# EAGLE schematic CANtranslator (EAGLE 6.1)
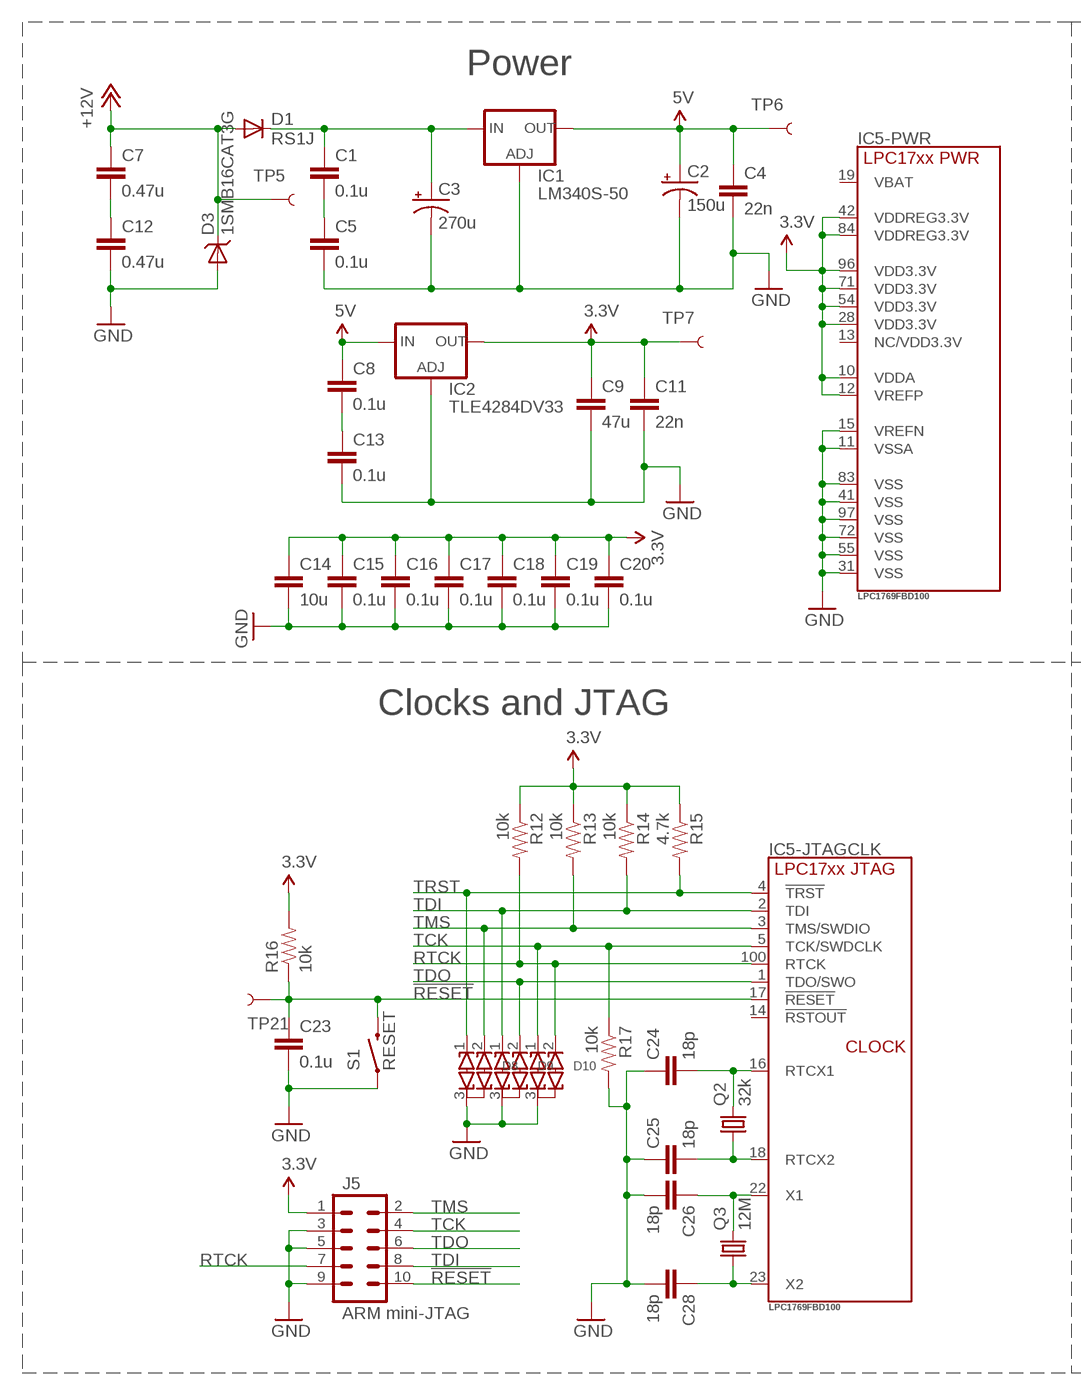
[diagram p0: schematic, sheet 1, part 1 of 2]
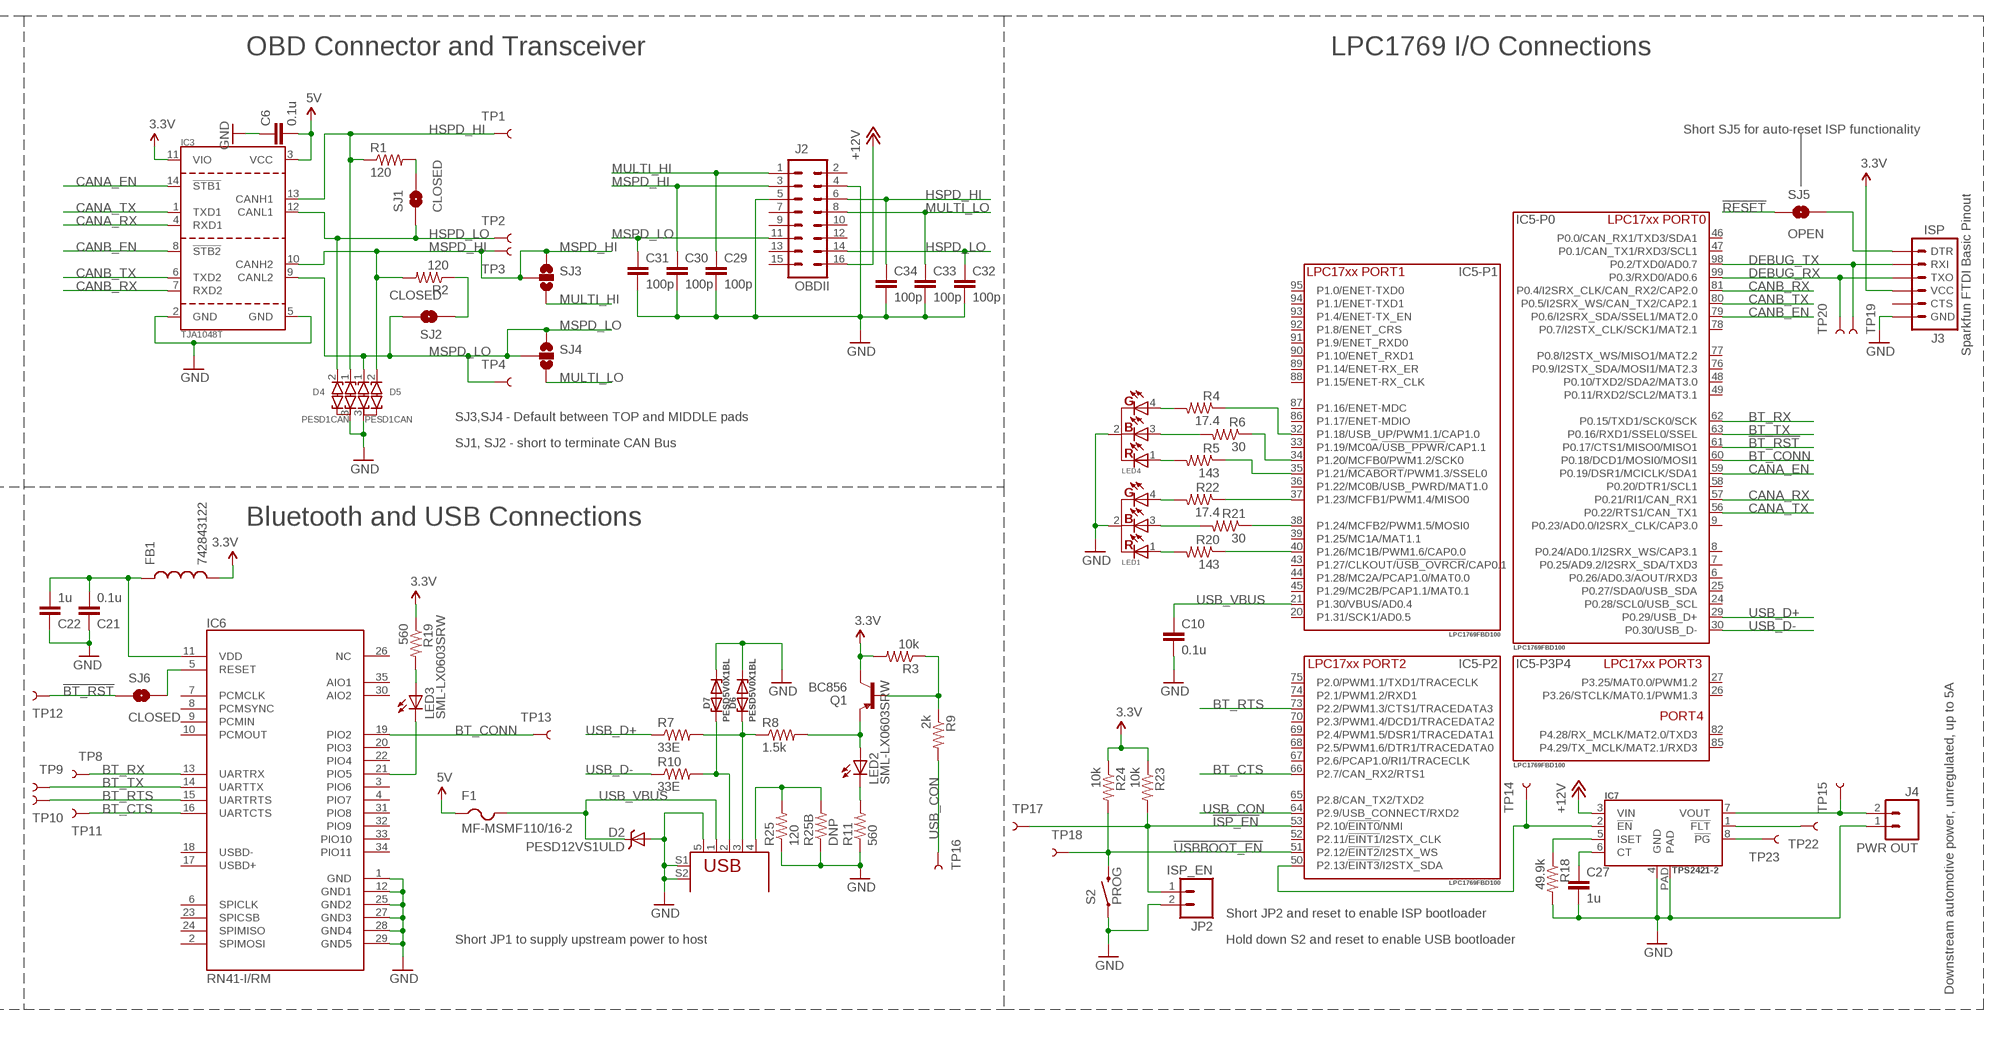
[diagram p1: schematic, sheet 1, part 2 of 2]

## Parts
C1  0.1u  CAP0805  [0805]
C2  150u  CAP_POL5MMX2D  [CPOL-5MMX2D]
C3  270u  CAP_POL10MMX5D  [CPOL-10MMX5D]
C4  22n  CAP0402-CAP  [0402-CAP]
C5  0.1u  CAP0805  [0805]
C6  0.1u  CAP0402-CAP  [0402-CAP]
C7  0.47u  CAP0805  [0805]
C8  0.1u  CAP0805  [0805]
C9  47u  CAP1210  [1210]
C10  0.1u  CAP0402-CAP  [0402-CAP]
C11  22n  CAP0402-CAP  [0402-CAP]
C12  0.47u  CAP0805  [0805]
C13  0.1u  CAP0805  [0805]
C14  10u  CAP0805  [0805]
C15  0.1u  CAP0402-CAP  [0402-CAP]
C16  0.1u  CAP0402-CAP  [0402-CAP]
C17  0.1u  CAP0402-CAP  [0402-CAP]
C18  0.1u  CAP0402-CAP  [0402-CAP]
C19  0.1u  CAP0402-CAP  [0402-CAP]
C20  0.1u  CAP0402-CAP  [0402-CAP]
C21  0.1u  CAP0402-CAP  [0402-CAP]
C22  1u  CAP0402-CAP  [0402-CAP]
C23  0.1u  CAP0402-CAP  [0402-CAP]
C24  18p  CAP0402-CAP  [0402-CAP]
C25  18p  CAP0402-CAP  [0402-CAP]
C26  18p  CAP0402-CAP  [0402-CAP]
C27  1u  CAP0402-CAP  [0402-CAP]
C28  18p  CAP0402-CAP  [0402-CAP]
C29  100p  CAP0402-CAP  [0402-CAP]
C30  100p  CAP0402-CAP  [0402-CAP]
C31  100p  CAP0402-CAP  [0402-CAP]
C32  100p  CAP0402-CAP  [0402-CAP]
C33  100p  CAP0402-CAP  [0402-CAP]
C34  100p  CAP0402-CAP  [0402-CAP]
D1  RS1J  DIODESMA  [SMA-DIODE]
D2  PESD12VS1ULD  DIODE-TVS-SOD882D  [SOD-882D]
D3  1SMB16CAT3G  DIODE-TVS-SMB  [SMB-DIODE]
D4  PESD1CAN  DIODE_ESD_DUAL-SOT-23  [SOT23]
D5  PESD1CAN  DIODE_ESD_DUAL-SOT-23  [SOT23]
D6  PESD5V0X1BL  DIODE_ESD_BI-SOD882  [SOD-882]
D7  PESD5V0X1BL  DIODE_ESD_BI-SOD882  [SOD-882]
D8  DIODE_ESD_DUAL-SOT-1123  [SOT-1123]
D9  DIODE_ESD_DUAL-SOT-1123  [SOT-1123]
D10  DIODE_ESD_DUAL-SOT-1123  [SOT-1123]
F1  MF-MSMF110/16-2  PTCFUSE-1206  [R1206]
FB1  742843122  INDUCTOR0402  [C0402]
IC1  LM340S-50  V_REG_317DPACK  [V-REG_DPACK]
IC2  TLE4284DV33  V_REG_317DPACK  [V-REG_DPACK]
IC3  TJA1048T  TJA1048-SO14  [SO14]
IC5  LPC1769FBD100  LPC1768_SPLIT-TQFP  [TQFP100]
IC6  RN41-I/RM  BLUETOOTH-RN41"  [RN41]
IC7  TPS2421-2  TPS2421SO8  [POWER_SO8]
J1  USB_MINIB_SHIELD-10118193  [10118193]
J2  OBDII  M08X2-OBDII-COMTECH  [OBDII-COMTECH]
J3  ISP  ARDUINO_SERIAL_PROGRAMPTH  [1X06]
J4  PWR OUT  M022-1445055-2  [2-1445055-2]
J5  ARM mini-JTAG  M05X2-SHF-105-01-X-D-SM  [SHF-105-01-X-D-SM]
JP2  ISP_EN  M02PTH  [1X02]
LED1  RGB  LED_3X_COMMON_CATHODE  [LED5MM-RGB]
LED2  SML-LX0603SRW  LED0603  [LED-0603]
LED3  SML-LX0603SRW  LED0603  [LED-0603]
LED4  RGB  LED_3X_COMMON_CATHODE  [LED5MM-RGB]
Q1  BC856  TRANSISTOR_PNPSMD  [SOT23-3]
Q2  32k  CRYSTAL-ST2012SB  [ST2012SB]
Q3  12M  CRYSTAL-CX3225SB  [CX3225SB]
R1  120  RESISTOR0402-RES  [0402-RES]
R2  120  RESISTOR0402-RES  [0402-RES]
R3  10k  RESISTOR0402-RES  [0402-RES]
R4  17.4  RESISTOR0402-RES  [0402-RES]
R5  143  RESISTOR0402-RES  [0402-RES]
R6  30  RESISTOR0402-RES  [0402-RES]
R7  33E  RESISTOR0402-RES  [0402-RES]
R8  1.5k  RESISTOR0402-RES  [0402-RES]
R9  2k  RESISTOR0402-RES  [0402-RES]
R10  33E  RESISTOR0402-RES  [0402-RES]
R11  560  RESISTOR0402-RES  [0402-RES]
R12  10k  RESISTOR0402-RES  [0402-RES]
R13  10k  RESISTOR0402-RES  [0402-RES]
R14  10k  RESISTOR0402-RES  [0402-RES]
R15  4.7k  RESISTOR0402-RES  [0402-RES]
R16  10k  RESISTOR0402-RES  [0402-RES]
R17  10k  RESISTOR0402-RES  [0402-RES]
R18  49.9k  RESISTOR0402-RES  [0402-RES]
R19  560  RESISTOR0402-RES  [0402-RES]
R20  143  RESISTOR0402-RES  [0402-RES]
R21  30  RESISTOR0402-RES  [0402-RES]
R22  17.4  RESISTOR0402-RES  [0402-RES]
R23  10k  RESISTOR0402-RES  [0402-RES]
R24  10k  RESISTOR0402-RES  [0402-RES]
R25  120  RESISTOR0402-RES  [0402-RES]
R25B  DNP  RESISTORPTH-1/4W  [AXIAL-0.4]
S1  RESET  SWITCH-MOMENTARY-2-SMD-1101NE  [TACTILE-SWITCH-1101NE]
S2  PROG  SWITCH-MOMENTARY-2-SMD-1101NE  [TACTILE-SWITCH-1101NE]
SJ1  CLOSED  SOLDERJUMPERTRACE  [SJ_2S-TRACE]
SJ2  CLOSED  SOLDERJUMPERTRACE  [SJ_2S-TRACE]
SJ3  SOLDERJUMPER_2WAYPASTE1&2  [SJ_3_PASTE1&2]
SJ4  SOLDERJUMPER_2WAYPASTE1&2  [SJ_3_PASTE1&2]
SJ5  OPEN  SOLDERJUMPERNO  [SJ_2S-NO]
SJ6  CLOSED  SOLDERJUMPERTRACE  [SJ_2S-TRACE]
TP1  TEST-POINT3X5  [PAD.03X.05]
TP2  TEST-POINT3X5  [PAD.03X.05]
TP3  TEST-POINT3X5  [PAD.03X.05]
TP4  TEST-POINT3X5  [PAD.03X.05]
TP5  TEST-POINT3X5  [PAD.03X.05]
TP6  TEST-POINT3X5  [PAD.03X.05]
TP7  TEST-POINT3X5  [PAD.03X.05]
TP8  TEST-POINT3X5  [PAD.03X.05]
TP9  TEST-POINT3X5  [PAD.03X.05]
TP10  TEST-POINT3X5  [PAD.03X.05]
TP11  TEST-POINT3X5  [PAD.03X.05]
TP12  TEST-POINT3X5  [PAD.03X.05]
TP13  TEST-POINT3X5  [PAD.03X.05]
TP14  TEST-POINT3X5  [PAD.03X.05]
TP15  TEST-POINT3X5  [PAD.03X.05]
TP16  TEST-POINT3X5  [PAD.03X.05]
TP17  TEST-POINT3X5  [PAD.03X.05]
TP18  TEST-POINT3X5  [PAD.03X.05]
TP19  TEST-POINT3X5  [PAD.03X.05]
TP20  TEST-POINT3X5  [PAD.03X.05]
TP21  TEST-POINT3X5  [PAD.03X.05]
TP22  TEST-POINT3X5  [PAD.03X.05]
TP23  TEST-POINT3X5  [PAD.03X.05]

## Nets
3.3V: C9.1 C11.1 C14.1 C15.1 C16.1 C17.1 C18.1 C19.1 C20.1 FB1.2 IC2.4(OUT) IC3.11(VIO) IC5.10(-PWR:VDDA) IC5.12(-PWR:VREFP) IC5.28(-PWR:VDD3.3V) IC5.42(-PWR:VDDREG3.3V) IC5.54(-PWR:VDD3.3V) IC5.71(-PWR:VDD3.3V) IC5.84(-PWR:VDDREG3.3V) IC5.96(-PWR:VDD3.3V) J3.4(VCC) J5.1 Q1.3(C) R3.2 R12.1 R13.1 R14.1 R15.1 R16.2 R19.1 R23.1 R24.1 TP7.P$1
5V: C2.1(+) C4.1 C6.2 C8.1 F1.1 IC1.4(OUT) IC2.3(IN) IC3.3(VCC) TP6.P$1
!BT_RST: IC5.61(-P0:P0.17/CTS1/MISO0/MISO1) SJ6.1 TP12.P$1
!ISP_EN: IC5.53(-P2:P2.10/!EINT0!/NMI) JP2.1 R23.2 TP17.P$1
!RESET: C23.1 IC5.17(-JTAGCLK:!RESET) J5.10 R16.1 S1.P$2 SJ5.1 TP21.P$1
!USBBOOT_EN: IC5.51(-P2:P2.12/!EINT2!/I2STX_WS) R24.2 S2.P$2 TP18.P$1
+12V: C7.1 D1.A D3.C IC7.3(VIN) J2.16 TP5.P$1
BT_CONN: IC5.60(-P0:P0.18/DCD1/MOSI0/MOSI1) IC6.19(PIO2) TP13.P$1
BT_CTS: IC5.66(-P2:P2.7/CAN_RX2/RTS1) IC6.16(UARTCTS) TP11.P$1
BT_RTS: IC5.73(-P2:P2.2/PWM1.3/CTS1/TRACEDATA3) IC6.15(UARTRTS) TP10.P$1
BT_RX: IC5.62(-P0:P0.15/TXD1/SCK0/SCK) IC6.13(UARTRX) TP8.P$1
BT_TX: IC5.63(-P0:P0.16/RXD1/SSEL0/SSEL) IC6.14(UARTTX) TP9.P$1
CANA_EN: IC3.14(!STB1) IC5.59(-P0:P0.19/DSR1/MCICLK/SDA1)
CANA_RX: IC3.4(RXD1) IC5.57(-P0:P0.21/RI1/CAN_RX1)
CANA_TX: IC3.1(TXD1) IC5.56(-P0:P0.22/RTS1/CAN_TX1)
CANB_EN: IC3.8(!STB2) IC5.79(-P0:P0.6/I2SRX_SDA/SSEL1/MAT2.0)
CANB_RX: IC3.7(RXD2) IC5.81(-P0:P0.4/I2SRX_CLK/CAN_RX2/CAP2.0)
CANB_TX: IC3.6(TXD2) IC5.80(-P0:P0.5/I2SRX_WS/CAN_TX2/CAP2.1)
DEBUG_RX: IC5.99(-P0:P0.3/RXD0/AD0.6) J3.3(TXO) TP20.P$1
DEBUG_TX: IC5.98(-P0:P0.2/TXD0/AD0.7) J3.2(RXI) TP19.P$1
GND: C2.2(-) C3.1(-) C4.2 C5.2 C6.1 C9.2 C10.2 C11.2 C12.2 C13.2 C14.2 C15.2 C16.2 C17.2 C18.2 C19.2 C20.2 C21.1 C22.1 C23.2 C24.1 C25.1 C26.2 C27.2 C28.2 C29.2 C30.2 C31.2 C32.2 C33.2 C34.2 D2.2(A) D3.A D4.3(COM) D5.3(COM) D6.1 D7.1 D8.3(COM) D9.3(COM) D10.3(COM) IC1.1(ADJ) IC2.1(ADJ) IC3.2(GND) IC3.5(GND) IC5.11(-PWR:VSSA) IC5.15(-PWR:VREFN) IC5.31(-PWR:VSS) IC5.41(-PWR:VSS) IC5.55(-PWR:VSS) IC5.72(-PWR:VSS) IC5.83(-PWR:VSS) IC5.97(-PWR:VSS) IC6.1(GND) IC6.12(GND1) IC6.25(GND2) IC6.27(GND3) IC6.28(GND4) IC6.29(GND5) IC7.4(GND) IC7.PAD J1.5(GND) J1.S1 J1.S2 J2.4 J2.5 J3.6(GND) J4.1 J5.3 J5.5 J5.9 JP2.2 LED1.2(C) LED4.2(C) R11.1 R17.2 R18.2 R25.1 R25B.P$1 S1.P$1 S2.P$1
HSPD_HI: C34.1 D4.1(C1) IC3.13(CANH1) J2.6 R1.1 TP1.P$1
HSPD_LO: C32.1 D4.2(C2) IC3.12(CANL1) J2.14 SJ1.1 TP2.P$1
MSPD_HI: C30.1 D5.2(C2) IC3.10(CANH2) J2.3 R2.2 SJ3.1 SJ3.2 TP3.P$1
MSPD_LO: C31.1 D5.1(C1) IC3.9(CANL2) J2.11 SJ2.2 SJ4.1 SJ4.2 TP4.P$1
MULTI_HI: C29.1 J2.1 SJ3.3
MULTI_LO: C33.1 J2.8 SJ4.3
N$1: R1.2 SJ1.2
N$2: IC5.40(-P1:P1.26/MC1B/PWM1.6/CAP0.0) R20.1
N$3: R2.1 SJ2.1
N$4: IC5.50(-P2:P2.13/!EINT3!/I2STX_SDA) IC7.2(!EN) TP14.P$1
N$5: LED1.4(G) R22.2
N$6: IC6.21(PIO5) LED3.C
N$7: C7.2 C12.1
N$8: LED3.A R19.2
N$9: IC5.38(-P1:P1.24/MCFB2/PWM1.5/MOSI0) R21.1
N$10: IC5.37(-P1:P1.23/MCFB1/PWM1.4/MISO0) R22.1
N$11: LED1.3(B) R21.2
N$12: LED1.1(R) R20.2
N$13: IC7.5(ISET) R18.1
N$14: C27.1 IC7.6(CT)
N$15: LED4.4(G) R4.2
N$16: IC5.32(-P1:P1.18/USB_UP/PWM1.1/CAP1.0) R4.1
N$17: C25.2 IC5.18(-JTAGCLK:RTCX2) Q2.1
N$18: C8.2 C13.1
N$19: J1.4(ID) R25.2 R25B.P$2
N$20: D7.2 J1.2(D-) R10.2
N$21: C1.2 C5.1
N$22: C1.1 C3.2(+) D1.C IC1.3(IN)
N$23: C24.2 IC5.16(-JTAGCLK:RTCX1) Q2.2
N$24: D6.2 J1.3(D+) R7.2 R8.1
N$25: C26.1 IC5.22(-JTAGCLK:X1) Q3.3
N$26: C28.1 IC5.23(-JTAGCLK:X2) Q3.1
N$27: LED2.A Q1.2(E) R8.2
N$28: LED2.C R11.2
N$29: Q1.1(B) R3.1 R9.1
N$30: LED4.3(B) R6.2
N$31: LED4.1(R) R5.2
N$32: IC5.34(-P1:P1.20/MCFB0/PWM1.2/SCK0) R6.1
N$33: IC5.35(-P1:P1.21/!MCABORT!/PWM1.3/SSEL0) R5.1
N$34: IC7.1(!FLT) TP22.P$1
N$35: IC7.8(!PG) TP23.P$1
N$36: J3.1(DTR) SJ5.2
N$37: IC6.5(RESET) SJ6.2
N$38: C21.2 C22.2 FB1.1 IC6.11(VDD)
RTCK: D10.2(C2) IC5.100(-JTAGCLK:RTCK) J5.7 R12.2
TCK: D10.1(C1) IC5.5(-JTAGCLK:TCK/SWDCLK) J5.4 R17.1
TDI: D9.1(C1) IC5.2(-JTAGCLK:TDI) J5.8 R14.2
TDO: D9.2(C2) IC5.1(-JTAGCLK:TDO/SWO) J5.6
TMS: D8.2(C2) IC5.3(-JTAGCLK:TMS/SWDIO) J5.2 R13.2
TRST: D8.1(C1) IC5.4(-JTAGCLK:!TRST) R15.2
USB_CON: IC5.64(-P2:P2.9/USB_CONNECT/RXD2) R9.2 TP16.P$1
USB_D+: IC5.29(-P0:P0.29/USB_D+) R7.1
USB_D-: IC5.30(-P0:P0.30/USB_D-) R10.1
USB_VBUS: C10.1 D2.1(C) F1.2 IC5.21(-P1:P1.30/VBUS/AD0.4) J1.1(VBUS)
VOUT: IC7.7(VOUT) J4.2 TP15.P$1
Unconnected: IC5.6(-P0:P0.26/AD0.3/AOUT/RXD3) IC5.7(-P0:P0.25/AD9.2/I2SRX_SDA/TXD3) IC5.8(-P0:P0.24/AD0.1/I2SRX_WS/CAP3.1) IC5.9(-P0:P0.23/AD0.0/I2SRX_CLK/CAP3.0) IC5.13(-PWR:NC/VDD3.3V) IC5.14(-JTAGCLK:!RSTOUT) IC5.19(-PWR:VBAT) IC5.20(-P1:P1.31/SCK1/AD0.5) IC5.24(-P0:P0.28/SCL0/USB_SCL) IC5.25(-P0:P0.27/SDA0/USB_SDA) IC5.26(-P3P4:P3.26/STCLK/MAT0.1/PWM1.3) IC5.27(-P3P4:P3.25/MAT0.0/PWM1.2) IC5.33(-P1:P1.19/MC0A/!USB_PPWR!/CAP1.1) IC5.36(-P1:P1.22/MC0B/USB_PWRD/MAT1.0) IC5.39(-P1:P1.25/MC1A/MAT1.1) IC5.43(-P1:P1.27/CLKOUT/!USB_OVRCR!/CAP0.1) IC5.44(-P1:P1.28/MC2A/PCAP1.0/MAT0.0) IC5.45(-P1:P1.29/MC2B/PCAP1.1/MAT0.1) IC5.46(-P0:P0.0/CAN_RX1/TXD3/SDA1) IC5.47(-P0:P0.1/CAN_TX1/RXD3/SCL1) IC5.48(-P0:P0.10/TXD2/SDA2/MAT3.0) IC5.49(-P0:P0.11/RXD2/SCL2/MAT3.1) IC5.52(-P2:P2.11/!EINT1!/I2STX_CLK) IC5.58(-P0:P0.20/DTR1/SCL1) IC5.65(-P2:P2.8/CAN_TX2/TXD2) IC5.67(-P2:P2.6/PCAP1.0/RI1/TRACECLK) IC5.68(-P2:P2.5/PWM1.6/DTR1/TRACEDATA0) IC5.69(-P2:P2.4/PWM1.5/DSR1/TRACEDATA1) IC5.70(-P2:P2.3/PWM1.4/DCD1/TRACEDATA2) IC5.74(-P2:P2.1/PWM1.2/RXD1) IC5.75(-P2:P2.0/PWM1.1/TXD1/TRACECLK) IC5.76(-P0:P0.9/I2STX_SDA/MOSI1/MAT2.3) IC5.77(-P0:P0.8/I2STX_WS/MISO1/MAT2.2) IC5.78(-P0:P0.7/I2STX_CLK/SCK1/MAT2.1) IC5.82(-P3P4:P4.28/RX_MCLK/MAT2.0/TXD3) IC5.85(-P3P4:P4.29/TX_MCLK/MAT2.1/RXD3) IC5.86(-P1:P1.17/ENET-MDIO) IC5.87(-P1:P1.16/ENET-MDC) IC5.88(-P1:P1.15/ENET-RX_CLK) IC5.89(-P1:P1.14/ENET-RX_ER) IC5.90(-P1:P1.10/ENET_RXD1) IC5.91(-P1:P1.9/ENET_RXD0) IC5.92(-P1:P1.8/ENET_CRS) IC5.93(-P1:P1.4/ENET-TX_EN) IC5.94(-P1:P1.1/ENET-TXD1) IC5.95(-P1:P1.0/ENET-TXD0) IC6.2(SPIMOSI) IC6.3(PIO6) IC6.4(PIO7) IC6.6(SPICLK) IC6.7(PCMCLK) IC6.8(PCMSYNC) IC6.9(PCMIN) IC6.10(PCMOUT) IC6.17(USBD+) IC6.18(USBD-) IC6.20(PIO3) IC6.22(PIO4) IC6.23(SPICSB) IC6.24(SPIMISO) IC6.26(NC) IC6.30(AIO2) IC6.31(PIO8) IC6.32(PIO9) IC6.33(PIO10) IC6.34(PIO11) IC6.35(AIO1) J2.2 J2.7 J2.9 J2.10 J2.12 J2.13 J2.15 J3.5(CTS)

## Notes on the sheet
- Power | OBD Connector and Transceiver | LPC1769 I/O Connections
- Short SJ5 for auto-reset ISP functionality
- Sparkfun FTDI Basic Pinout
- SJ3,SJ4 - Default between TOP and MIDDLE pads
- SJ1, SJ2 - short to terminate CAN Bus
- Clocks and JTAG | Bluetooth and USB Connections
- Downstream automotive power, unregulated, up to 5A
- Short JP2 and reset to enable ISP bootloader
- Short JP1 to supply upstream power to host | Hold down S2 and reset to enable USB bootloader

## Library data of the parts
C1 C4-C34 = BUG:CAP: Capacitor Standard 0603 ceramic capacitor, and 0.1" leaded capacitor.
C2 C3 = BUG:CAP_POL: Capacitor Polarized These are standard SMD and PTH capacitors. Normally 10uF, 47uF, and 100uF in electrolytic and tantalum varieties. Always verify the external diameter of the through hole cap, it varies with capacity, voltage, and manufacturer. The EIA devices should be standard.
D1 = BUG:DIODE: Diode These are standard reverse protection diodes and small signal diodes. SMA package can handle up to about 1A. SOD-323 can handle about 200mA. What the SOD-323 package when ordering, there are some mfgs out there that are 5-pin packages.
D2 D3 = BUG:DIODE-TVS
D4 D5 D8-D10 = BUG:DIODE_ESD_DUAL: Dual ESD Diode, with a common anode
D6 D7 = BUG:DIODE_ESD_BI
F1 = adafruit:PTCFUSE: PTC fuses, resettable thermistors
FB1 = BUG:INDUCTOR: Inductors Basic Inductor/Choke - 0603 and 1206. Footprints are not proven and vary greatly between part numbers.
IC1 IC2 = SparkFun-PowerIC:V_REG_317: Voltage Regulator Standard LM317 adjustable voltage regulator. AOI (Adjust Output Input). Google 'LM317 Calculator' for easy to use app to get the two resistor values needed. 240/720 for 5V output. 240/390 for 3.3V output. Spark Fun Electronics SKU : COM-00527
IC3 = BUG:TJA1048
IC5 = BUG:LPC1768_SPLIT: LPC1768 ARM Cortex M3 32-Bit microprocessor
IC6 = SparkFun-RF:BLUETOOTH-RN41: Bluetooth SMD module
IC7 = BUG:TPS2421
J1 = BUG:USB_MINIB_SHIELD
J2 = BUG:M08X2: .1" headers, two rows of 8 each
J3 = SparkFun-Connectors:ARDUINO_SERIAL_PROGRAM: FTDI connector footprints
J4 = BUG:M02: Header 2 Standard 2-pin 0.1" header. Use with straight break away headers (SKU : PRT-00116), right angle break away headers (PRT-00553), swiss pins (PRT-00743), machine pins (PRT-00117), and female headers (PRT-00115). Molex polarized connector foot print use with SKU : PRT-08233 with associated crimp pins and housings.
J5 = BUG:M05X2: Header 5x2 Standard 10-pin dual row header. Multiple pitches available - check package.
JP2 = SparkFun-Connectors:M02: Header 2 Standard 2-pin 0.1" header. Use with straight break away headers (SKU : PRT-00116), right angle break away headers (PRT-00553), swiss pins (PRT-00743), machine pins (PRT-00117), and female headers (PRT-00115). Molex polarized connector foot print use with SKU : PRT-08233 with associated crimp pins and housings.
LED1 LED4 = BUG:LED_3X_COMMON_CATHODE
LED2 LED3 = BUG:LED: LEDs Standard schematic elements and footprints for 5mm, 3mm, 1206, and 0603 sized LEDs. 5mm - Spark Fun Electronics SKU : COM-00529 (and others)
Q1 = SparkFun-DiscreteSemi:TRANSISTOR_PNP: Generic PNP BJT. Double check pinouts against datasheets- not all devices are the same!
Q2 Q3 = BUG:CRYSTAL: CRYSTAL
R1-R25 R25B = BUG:RESISTOR: Resistor Basic schematic elements and footprints for 0603, 1206, and PTH resistors.
S1 S2 = SparkFun-Electromechanical:SWITCH-MOMENTARY-2: Various NO switches- pushbuttons, reed, etc
SJ1 SJ2 SJ5 SJ6 = SparkFun-Passives:SOLDERJUMPER: Solder Jumper Standard SMD solder jumper. Used to automate production. Two varients : Normally Open and Normally Closed are the same, but have different paste layers. NC will have a large amount of paste and should jumper during reflow.
SJ3 SJ4 = SparkFun-Passives:SOLDERJUMPER_2WAY: Solder Jumper 2 way solder jumper
TP1-TP23 = SparkFun-Passives:TEST-POINT: Bare copper test points for troubleshooting or ICT